# EAGLE design LampSchematic_movergb (EAGLE 7.3.0)
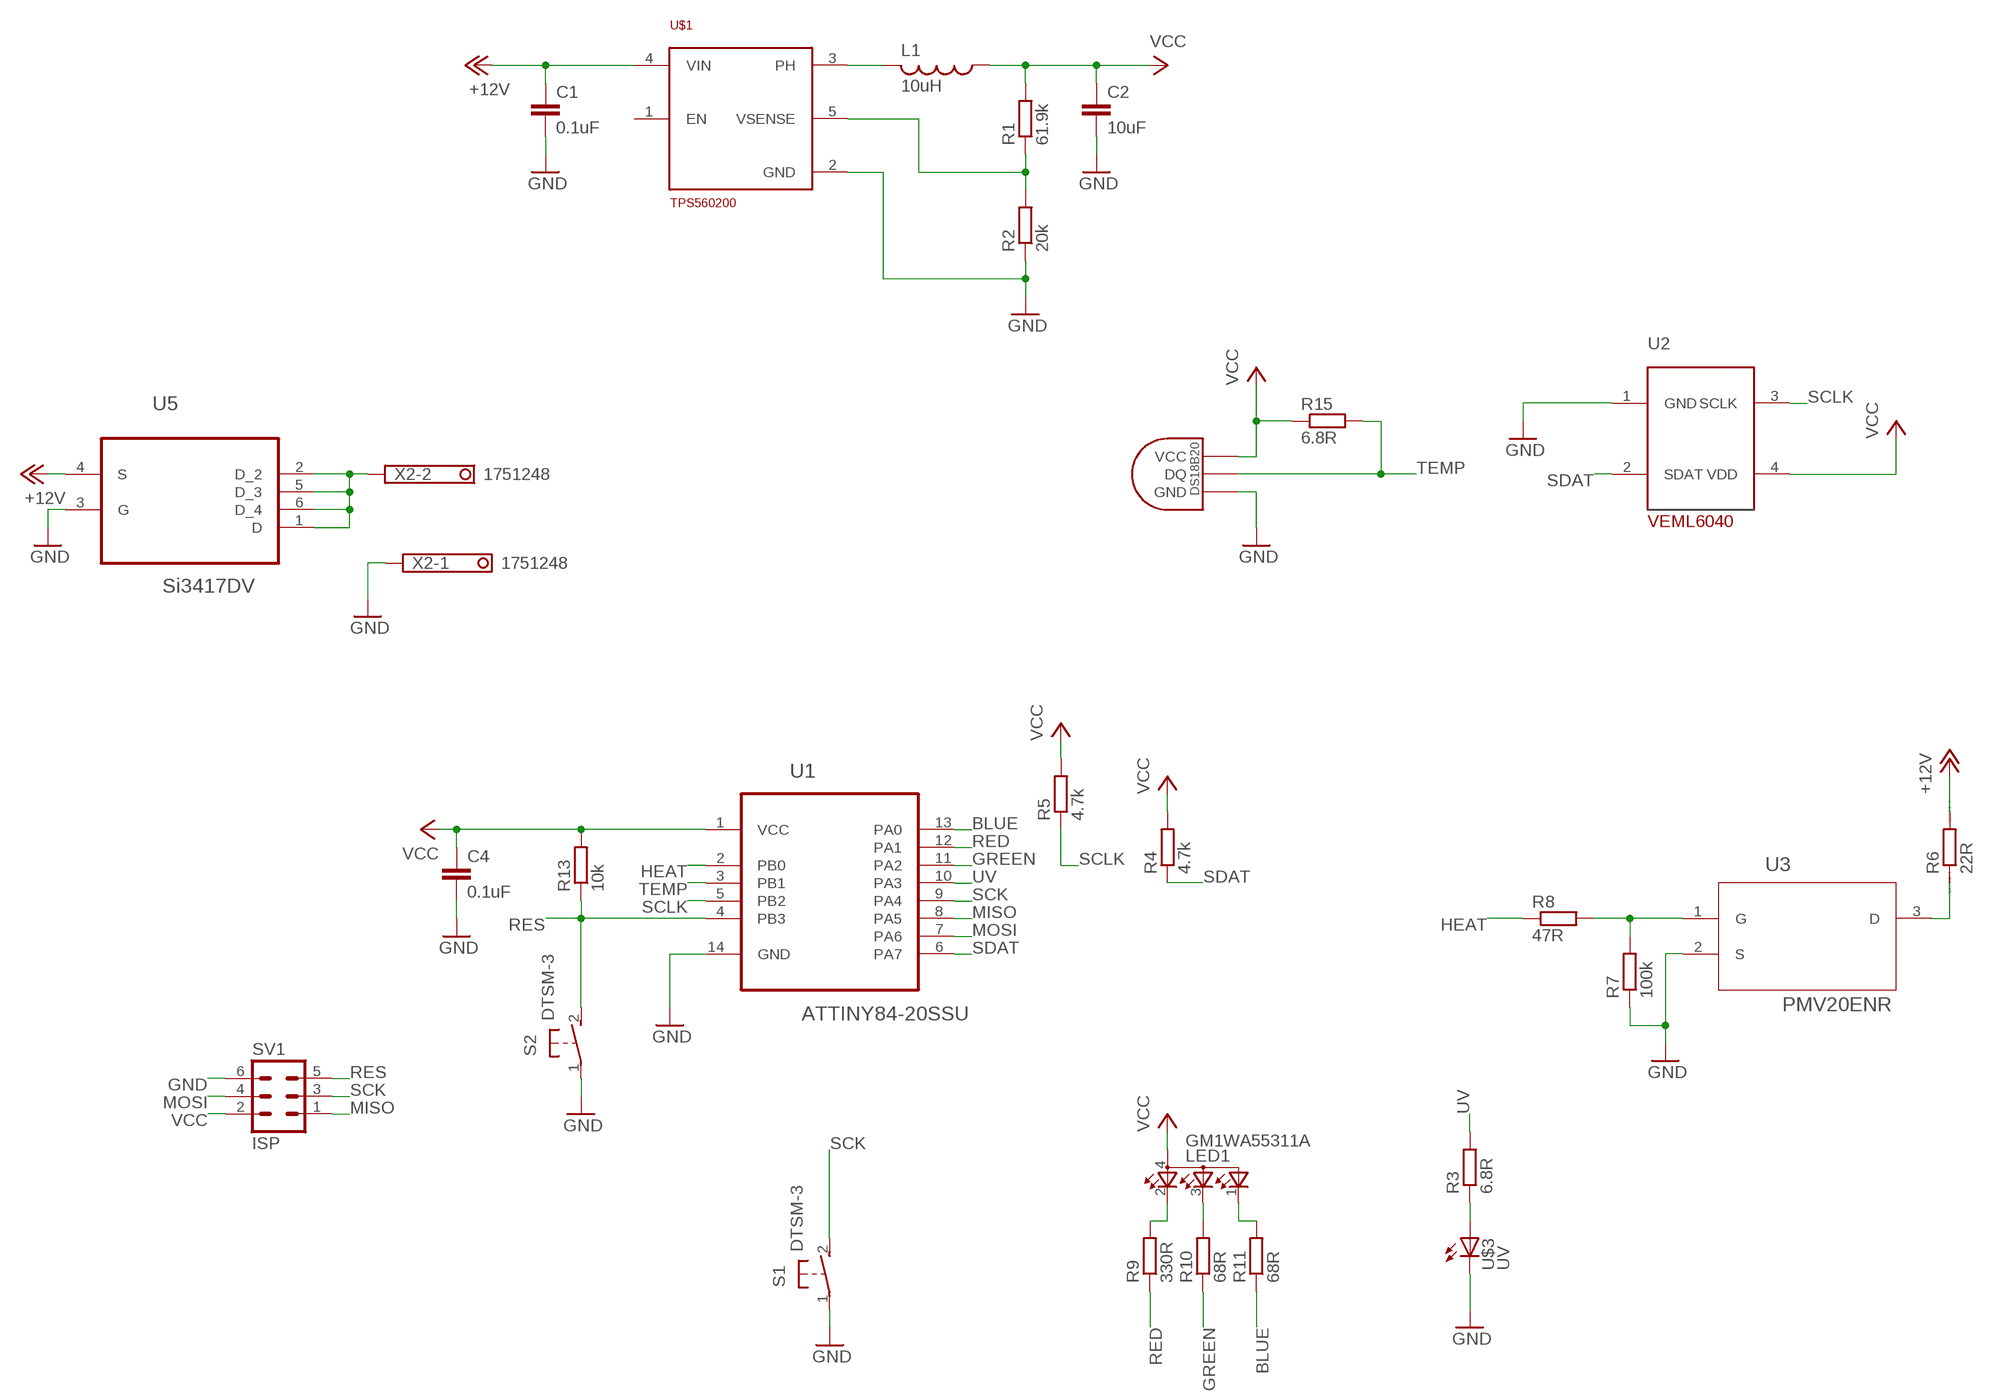
[diagram p0: schematic, sheet 1]

## Parts
C1  0.1uF  C-EUC0805  [C0805]
C2  10uF  C-EUC0805  [C0805]
C4  0.1uF  C-EUC0805  [C0805]
L1  10uH  L-USL2012C  [L2012C]
LED1  GM1WA55311A  [GM1WA55311A]
R1  61.9k  R-EU_R0805  [R0805]
R2  20k  R-EU_R0805  [R0805]
R3  6.8R  R-EU_R0805  [R0805]
R4  4.7k  R-EU_R0805  [R0805]
R5  4.7k  R-EU_R0805  [R0805]
R6  22R  R  [5WRESISTOR]
R7  100k  R-EU_R0805  [R0805]
R8  47R  R-EU_R0805  [R0805]
R9  330R  R-EU_R0805  [R0805]
R10  68R  R-EU_R0805  [R0805]
R11  68R  R-EU_R0805  [R0805]
R13  10k  R-EU_R0805  [R0805]
R15  6.8R  R-EU_R0805  [R0805]
S1  DTSM-3  [DTSM-3]
S2  DTSM-3  [DTSM-3]
SV1  ISP  MA03-2  [MA03-2]
U1  ATTINY84-20SSU  [SOIC127P600X175-14N]
U2  VEML6040  [VEML6040]
U3  PMV20ENR  [SOT95P230X110-3N]
U5  Si3417DV  SI3417DV-T1-GE3  [SOP95P285X110-6N]
U$1  TPS560200  [SOT23-5L]
U$2  DS1820TO92  [DS1820]
U$3  UV  [GM5BW96385A]
X2  1751248  [1751248]

## Nets
+12V: C1.1 R6.P$2 U5.4(S) U$1.4(VIN)
BLUE: R11.1 U1.13(PA0)
GND: C1.2 C2.2 C4.2 R2.1 R7.1 S1.1 S2.1 SV1.6 U1.14(GND) U2.1(GND) U3.2(S) U5.3(G) U$1.2(GND) U$2.GND U$3.2 X2.1
GREEN: R10.1 U1.11(PA2)
HEAT: R8.1 U1.2(PB0)
MISO: SV1.1 U1.8(PA5)
MOSI: SV1.4 U1.7(PA6)
N$1: L1.2 U$1.3(PH)
N$2: R1.1 R2.2 U$1.5(VSENSE)
N$4: R6.P$1 U3.3(D)
N$5: R7.2 R8.2 U3.1(G)
N$6: LED1.2(CRED) R9.2
N$7: LED1.3(CBLUE) R10.2
N$8: LED1.1(CGREEN) R11.2
N$9: R3.1 U$3.1
N$11: U5.1(D) U5.2(D_2) U5.5(D_3) U5.6(D_4) X2.2
RED: R9.1 U1.12(PA1)
RES: R13.1 S2.2 SV1.5 U1.4(PB3)
SCK: S1.2 SV1.3 U1.9(PA4)
SCLK: R5.1 U1.5(PB2) U2.3(SCLK)
SDAT: R4.1 U1.6(PA7) U2.2(SDAT)
TEMP: R15.2 U1.3(PB1) U$2.DQ
UV: R3.2 U1.10(PA3)
VCC: C2.1 C4.1 L1.1 LED1.4(A) R1.2 R4.2 R5.2 R13.2 R15.1 SV1.2 U1.1(VCC) U2.4(VDD) U$2.VDD(VCC)
Unconnected: U$1.1(EN)

## Library data of the parts
C1 C2 C4 = resistor:C-EU: CAPACITOR, European symbol
L1 = resistor:L-US: INDUCTOR, American symbol
LED1 = MyParts:GM1WA55311A: Chip LED RGB Source: http://document.sharpsma.com/files/GM1WA55311A_SS.pdf
R1-R5 R7-R11 R13 R15 = resistor:R-EU_: RESISTOR, European symbol
R6 = MyParts:R
S1 S2 = switch-tact:DTSM-3
SV1 = con-lstb:MA03-2: PIN HEADER; OC_FARNELL: unknown; OC_NEWARK: unknown
U1 = Atmel_By_element14_Batch_1-00:ATTINY84-20SSU: 8-bit Microcontroller with Bytes In-System Programmable Flash; MPN: ATTINY84-20SSU; OC_FARNELL: 1636955; OC_NEWARK: 03P2040; PACKAGE: SOIC-14; SUPPLIER: Atmel
U2 = MyParts:VEML6040: VEML6040 Selectable maximum detection range (360, 721, 1442, 2883, 5767, or 11 796) lux with highest sensitivity 0.0056 lux/step. Temperature compensation: -40 °C to +85 °C Operation voltage: 2.5 V to 3.6 V.
U3 = MyParts:PMV20ENR
U5 = MyParts:SI3417DV-T1-GE3: Id - Continuous Drain Current: 8 A Vds - Drain-Source Breakdown Voltage: - 30 V Rds On - Drain-Source Resistance: 30 mOhms Transistor Polarity: P-Channel Vgs - Gate-Source Breakdown Voltage: 20 V
U$1 = MyParts:TPS560200
U$2 = Ava:DS1820: DS18B20 Programmable Resolution 1-Wire Digital Thermometer Description The DS18B20 digital thermometer provides 9-bit to 12-bit Celsius temperature measurements and has an alarm function with nonvolatile user-programmable upper and lower trigger points. The DS18B20 communicates over a 1-Wire® bus that by definition requires only one data line (and ground) for communication with a central microprocessor. It has an operating temperature range of -55°C to +125°C and is accurate to ±0.5°C over the range of -10°C to +85°C. In addition, the DS18B20 can derive power directly from the data line ("parasite power"), eliminating the need for an external power supply. Each DS18B20 has a unique 64-bit serial code, which allows multiple DS18B20s to function on the same 1-Wire bus. Thus, it is simple to use one microprocessor to control many DS18B20s distributed over a large area. Applications that can benefit from this feature include HVAC environmental controls, temperature monitoring systems inside buildings, equipment, or machinery, and process monitoring and control systems.
U$3 = MyParts:UV
X2 = con-phoenix-350:1751248: MKDS 1/ 2-3,5 Printklemme Nennstrom: 10 A Bemessungsspannung: 160 V Raster: 3,5 mm Polzahl: 2 Montageart: Löten Anschlussart: Schraubanschluss Anschlussrichtung vom Leiter zur Platine: 0° Source: http://eshop.phoenixcontact.com .. 1751248.pdf; OC_FARNELL: unknown; OC_NEWARK: unknown

## Board
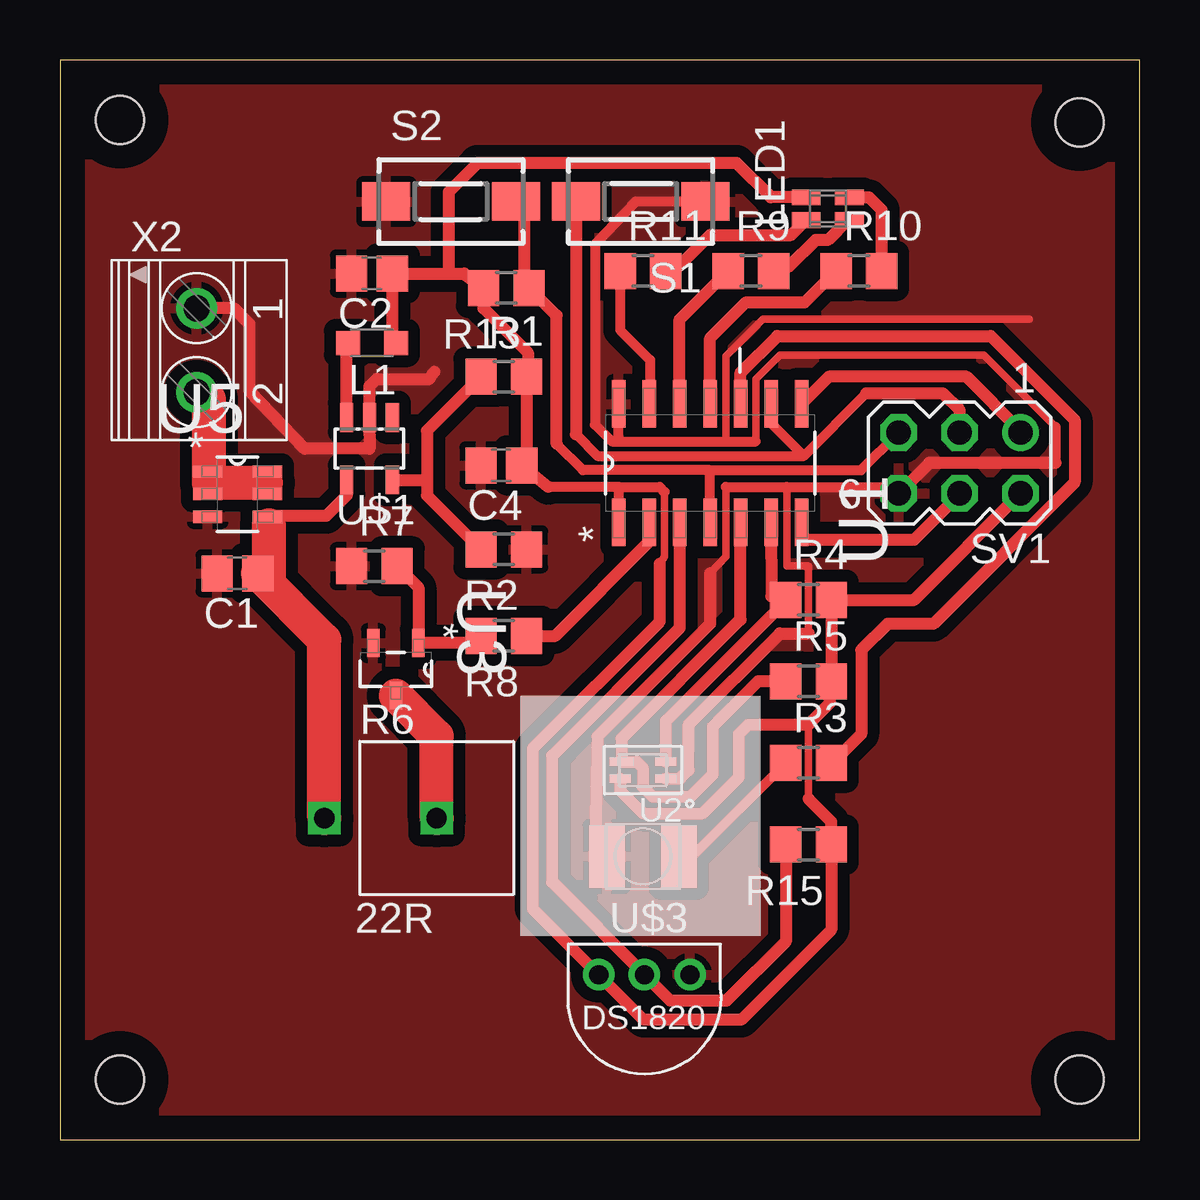
[diagram p1: board, top side]

Size 45 x 45 mm. Coordinates in mm from the lower left corner, seen from the top.
Outline: 0,0 45,0 45,45 0,45 0,0
Copper layers (1*16): Top 0.035mm / dielectric 1.5mm / Bottom 0.035mm
Design rules "default": minimum track width 10mil, minimum drill 24mil, track to track 8mil, track to pad 8mil, pad to pad 8mil, via to via 8mil, smd to smd 8mil, copper to edge 40mil, drill to drill 8mil, minimum pad ring 10mil, minimum via ring 8mil, stop-mask expansion 4mil, vias tented up to drill 0mil, thermal gap 10mil
Holes 2 mm at 2.5,42.5 42.5,42.4 2.5,2.5 42.5,2.5

### Footprints (pad centres in the part's own frame; a part is rotated, then mirrored left to right if it is on the bottom)
C0805 = smd 1.3 x 1.5: 1 -0.85,0; 2 0.85,0
L2012C = smd 1 x 1: 1 -1,0; 2 1,0
GM1WA55311A = smd 0.65 x 1.2: 1 -0.475,0.9; 2 -0.475,-0.9; 3 0.475,-0.9; 4 0.475,0.9
R0805 = smd 1.3 x 1.5: 1 -0.95,0; 2 0.95,0
5WRESISTOR = drill 0.85 square: P$1 0,0; P$2 -4.68,0
DTSM-3 = smd 2 x 1.6: 1 -2.7,0; 2 2.7,0
MA03-2 = drill 1.016: 1 -2.54,-1.27 | drill 1.016 octagon: 2 -2.54,1.27; 3 0,-1.27; 4 0,1.27; 5 2.54,-1.27; 6 2.54,1.27
SOIC127P600X175-14N = smd 1.981 x 0.559: 1 -2.464,3.81; 2 -2.464,2.54; 3 -2.464,1.27; 4 -2.464,0; 5 -2.464,-1.27; 6 -2.464,-2.54; 7 -2.464,-3.81; 8 2.464,-3.81; 9 2.464,-2.54; 10 2.464,-1.27; 11 2.464,0; 12 2.464,1.27; 13 2.464,2.54; 14 2.464,3.81
VEML6040 = smd 0.9 x 0.35: 1 -0.95,0.35; 2 -0.95,-0.35; 4 0.95,0.35 | smd 1 x 0.35: 3 0.9,-0.35
SOT95P230X110-3N = smd 1.168 x 0.533: 1 -1.092,0.94; 2 -1.092,-0.94; 3 1.092,0
SOP95P285X110-6N = smd 1.219 x 0.508: 1 -1.245,0.94; 2 -1.245,0; 3 -1.245,-0.94; 4 1.245,-0.94; 5 1.245,0; 6 1.245,0.94
SOT23-5L = smd 0.55 x 1.2: 1 -0.95,-1.3; 2 0,-1.3; 3 0.95,-1.3; 4 0.95,1.3; 5 -0.95,1.3
DS1820 = drill 0.8: DQ 2.54,-1.27; GND 0.635,-1.27; VDD 4.445,-1.27
GM5BW96385A = smd 1.5 x 2.6: 1 -1.5,0; 2 1.5,0
1751248 = drill 1.1 pad 1.7: 1 -1.75,-0.1; 2 1.75,-0.1

### Placement (x,y rotation side)
C1  7.4,23.6 180 top
C2  13,36.1 180 top
C4  18.4,28.1 180 top
L1  13,33.2 180 top
LED1  32,38.8 90 top
R1  18.5,31.8 0 top
R2  18.5,24.6 180 top
R3  31.2,15.7 0 top
R4  31.2,22.5 0 top
R5  31.2,19.1 0 top
R6  15.7,13.4 0 top
R7  13.1,23.9 0 top
R8  18.5,21 180 top
R9  28.8,36.2 0 top
R10  33.3,36.2 0 top
R11  24.3,36.2 0 top
R13  18.6,35.5 180 top
R15  31.2,12.3 180 top
S1  24.2,39.1 180 top
S2  16.3,39.1 0 top
SV1  37.5,28.2 180 top
U1  27.1,28.2 90 top
U2  24.3,15.4 180 top
U3  14,19.6 270 top
U5  7.4,26.9 0 top
U$1  12.9,28.8 180 top
U$2  26.9,5.6 180 top
U$3  24.3,11.8 180 top
X2  5.8,32.9 270 top

### Tracks (layer width: path | path; a pad name or v marks a point on that pad's centre or on a via)
+12V
  Top 0.5: 8.64,25.25 U5.4 8.68,26 11.1,26 11.95,26.85 U$1.4
  Top 0.61: 8.64,25.25 arc-90 8.7,25.6 | 8.7,23.3 arc-90 C1.1
  Top 1.422: 8.7,25.6 8.7,23.3 | R6.P$2 11.02,20.83 C1.1
BLUE
  Top 0.406: R11.1 23.35,33.75 24.6,32.5 24.6,30.7 U1.13
GND
  Top 0.305: 27.75,29.1 27.75,32.65 29.3,34.2 40.4,34.2 | 27.75,27.2 27.75,24.3 27.1,23.6 | 30.3,27.2 30.3,23.9 31.2,23.9 31.2,21.1 | 29,29.1 29,31.7 30,32.7 38.5,32.7 41.5,29.7
  Top 0.406: 23,29.1 27.75,29.1 29,29.1 | 27.75,27.2 30.3,27.2 35.2,27.2 | 41.5,28.2 41.5,29.7 | S1.1 24,39.1 22.3,37.3 22.3,29.8 23,29.1 | 23.25,30.8 U1.14 23.29,29.11 23.01,29.11 23,29.1 | U$1.2 12.9,29.4
  Top 0.5: 35.2,27.2 34.95,26.95 34.35,26.94 SV1.6 36.23,28.2 41.5,28.2 | 27.1,23.6 27.1,21.5 22.4,16.8 22.3,12.7 U$3.2 | U2.1 25.85,15.05 26.2,15.4 26.2,17.3 30,21.1 31.2,21.1 | X2.1 7.25,34.65 7.9,34 7.9,31.2 10.2,28.8 12.9,28.8 12.9,29.4 12.9,31.4 13.2,31.7 15.4,31.7 15.6,32
  pour Top (isolate 0.5): -0.45,47 -0.55,-0.45 45.7,-0.5 45.65,46.95
GREEN
  Top 0.5: U1.11 27.1,33.4 28.6,34.9 31.05,34.9 R10.1
HEAT
  Top 0.5: U1.2 24.56,24.91 20.65,21 R8.1
MISO
  Top 0.5: SV1.1 40.04,29.56 37.8,31.8 32.05,31.8 U1.8
MOSI
  Top 0.5: SV1.4 37.5,26.9 35.6,25 31,25 30.9,25.1 30.9,25.73 U1.7
N$1
  Top 0.5: U$1.3 11.95,32.95 L1.2
N$2
  Top 0.5: R1.1 15.3,29.55 15.3,27.5 | 15.3,27.5 15.3,26.85 R2.2 | U$1.5 15.3,27.5
N$4
  Top 1.422: R6.P$1 15.7,16.81 U3.3
N$5
  Top 0.5: R8.2 17.24,20.69 U3.1 14.94,23.01 R7.2
N$6
  Top 0.5: LED1.2 32.83,38.33 32,37.5 31.5,37.5 30.4,36.4 29.95,36.4 R9.2
N$7
  Top 0.5: R10.2 34.25,38.75 33.73,39.27 LED1.3
N$8
  Top 0.5: R11.2 25.6,36.2 27.1,37.7 30.48,37.7 LED1.1
N$9
  Top 0.406: U$3.1 26.35,11.8 R3.1
  Top 0.5: 26.1,10.8 U$3.1
N$11
  Top 0.5: X2.2 6.2,30.85 | 6.2,27.38 U5.1 U5.2 | U5.5 U5.6 8.59,27.38
  Top 1.422: 6.2,30.85 6.2,27.38 8.59,27.38
RED
  Top 0.5: U1.12 25.83,34.18 R9.1
RES
  Top 0.406: 27.1,27.9 33.39,27.9 SV1.5 | U1.4 27.1,27.9 | 27.1,27.9 21.8,27.9 20.7,29
  Top 0.5: S2.2 19.35,38.55 19.35,35.7 R13.1 20.7,34.35 20.7,29
SCK
  Top 0.406: 29.6,30.62 U1.9 29.64,29.86 31,28.5 | 31,28.5 22.4,28.5 21.5,29.4 | 31,28.5 33.6,31.1
  Top 0.5: SV1.3 37.5,30.4 36.8,31.1 33.6,31.1 | S1.2 21.5,29.4
SCLK
  Top 0.5: U1.5 28.37,21.67 23.4,16.7 U2.3 24.05,15.75 24.3,15.5 24.3,14.7 24.7,14.3 26.3,14.3 27.2,15.2 27.2,17.2 29.1,19.1 R5.1
SDAT
  Top 0.5: U1.6 29.65,22.64 R4.1 30.25,22.45 25.25,17.45 U2.2
TEMP
  Top 0.5: U1.3 25.83,21.33 20.5,16 20.5,10.73 U$2.DQ 25.43,5.8 27.8,5.8 30.25,8.25 R15.2
UV
  Top 0.5: U1.10 28.37,31.97 29.9,33.5 38.8,33.5 42.3,30 42.3,27.4 36.4,21.5 34.5,21.5 33.4,20.4 33.4,16.9 32.2,15.7 R3.2 32.15,16.15
VCC
  Top 0.305: 25.2,27 25.2,24.3 25,24 | 31.2,14.2 31.2,17.3
  Top 0.406: 25.2,27 25,27.2 23.3,27.2 | U1.1 23.3,27.2 | 23.3,27.2 20.35,27.2
  Top 0.5: 40.08,26.88 SV1.2 35.61,22.5 R4.2 R5.2 32.1,19.05 32.1,18.2 31.2,17.3 28.7,17.3 28.3,16.9 28.3,15.1 26.8,13.6 24.3,13.6 23.35,14.55 U2.4 | U1.1 | 17.4,35.45 R13.2 | LED1.4 29.62,39.27 28.2,40.7 17.4,40.7 16.2,39.5 16.2,36.1 | 25,24 25,21.6 19.7,16.3 19.7,9.62 U$2.VDD 24.32,5 28.4,5 32.15,8.75 R15.1 32.15,13.25 31.2,14.2 | L1.1 13.85,33.15 C2.1 16.2,36.1 | 16.2,36.1 16.85,36.1 R13.2 | R13.2 17.65,34.65 19.5,32.8 19.5,31.85 R1.2 19.45,28.3 C4.1 20.35,27.2